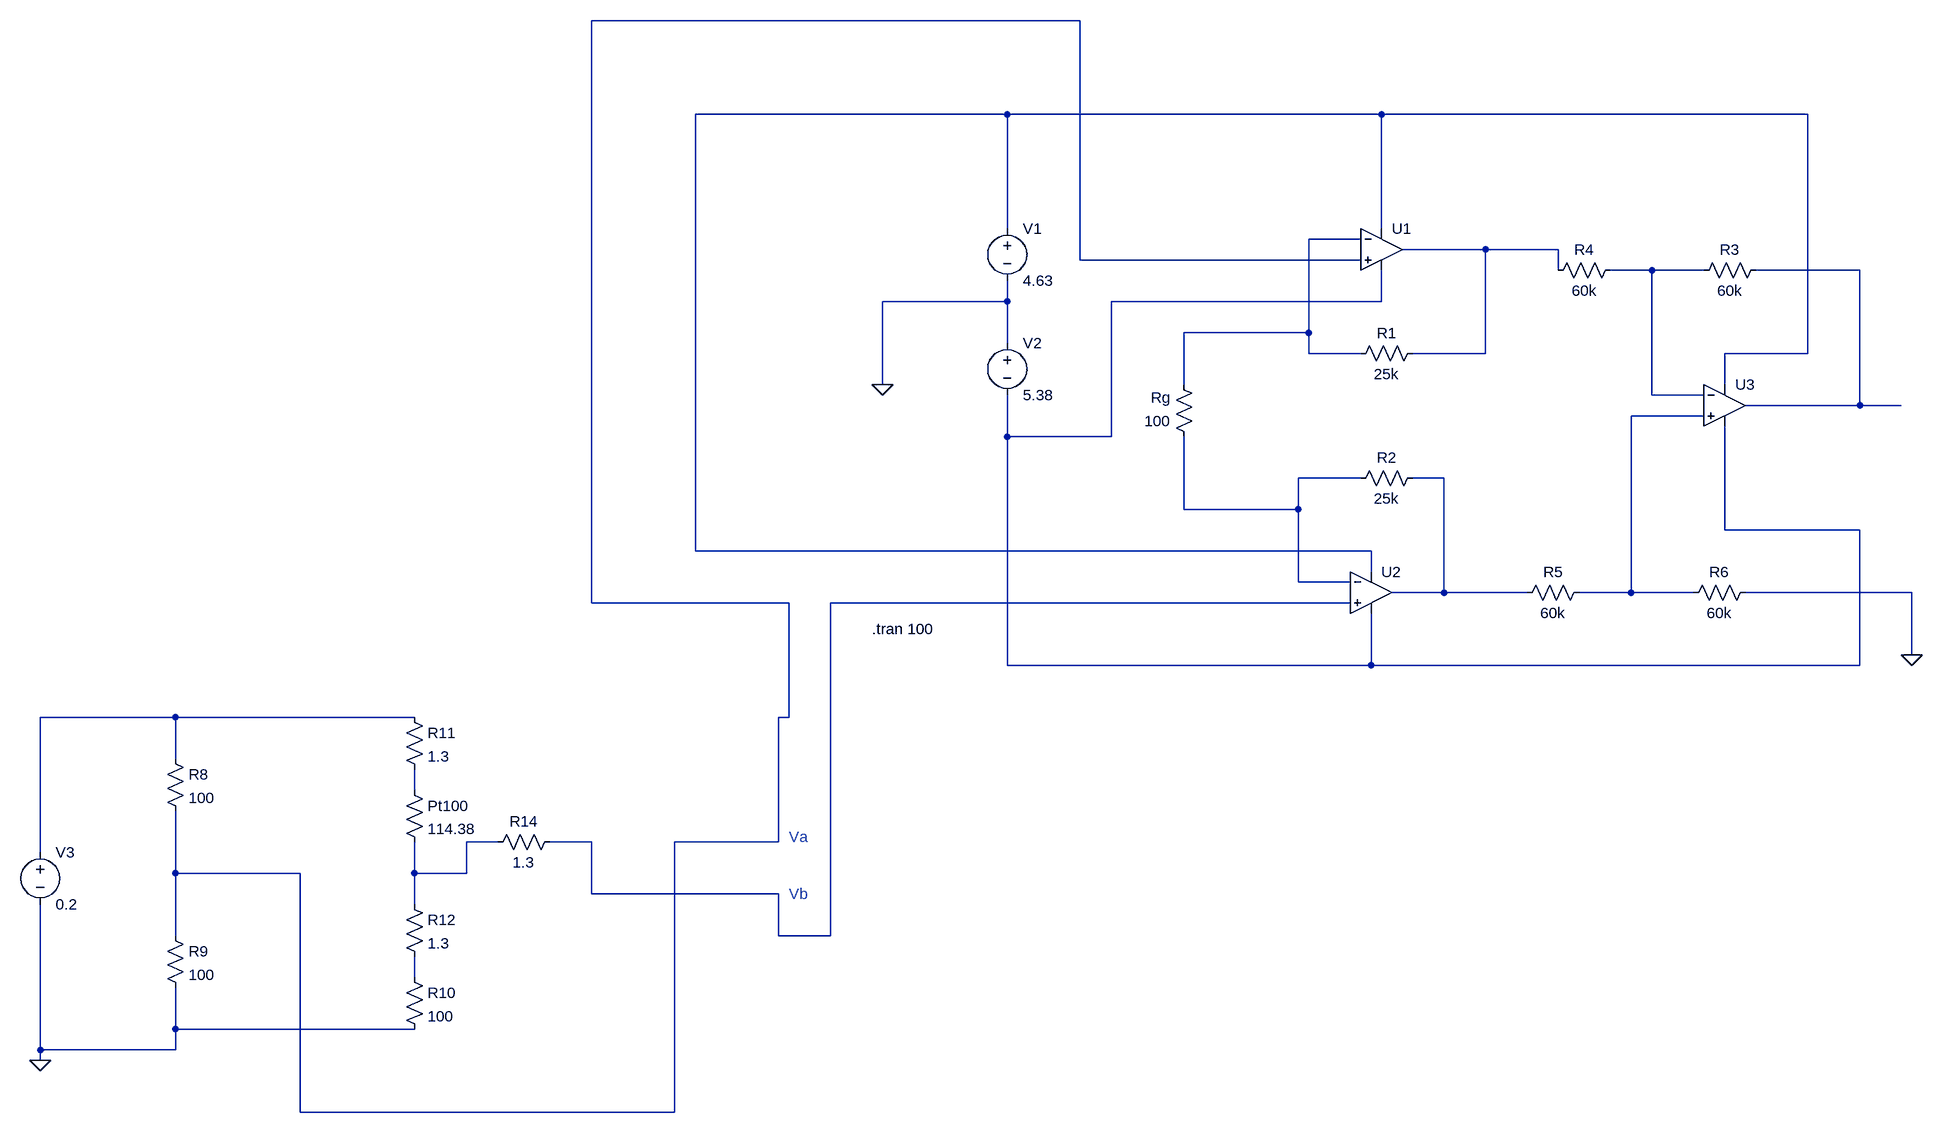
[diagram p0: schematic simulacaoINA118_com_ponte.asc]
simulacaoINA118_com_ponte.asc, the LTspice schematic file:
Version 4.1
SHEET 1 1108 1412
WIRE -544 -272 -1296 -272
WIRE -656 -128 -1136 -128
WIRE -80 -128 -656 -128
WIRE 576 -128 -80 -128
WIRE -656 48 -656 -128
WIRE -80 48 -80 -128
WIRE -112 64 -192 64
WIRE 80 80 -48 80
WIRE 192 80 80 80
WIRE -544 96 -544 -272
WIRE -112 96 -544 96
WIRE 192 112 192 80
WIRE 336 112 272 112
WIRE 416 112 336 112
WIRE 656 112 496 112
WIRE -656 160 -656 128
WIRE -656 160 -848 160
WIRE -80 160 -80 112
WIRE -80 160 -496 160
WIRE -192 208 -192 64
WIRE -192 208 -384 208
WIRE -656 224 -656 160
WIRE -192 240 -192 208
WIRE -112 240 -192 240
WIRE 80 240 80 80
WIRE 80 240 -32 240
WIRE 576 240 576 -128
WIRE 576 240 448 240
WIRE -848 288 -848 160
WIRE -384 288 -384 208
WIRE 448 288 448 240
WIRE 336 304 336 112
WIRE 416 304 336 304
WIRE 656 320 656 112
WIRE 656 320 480 320
WIRE 720 320 656 320
WIRE 416 336 304 336
WIRE -656 368 -656 304
WIRE -496 368 -496 160
WIRE -496 368 -656 368
WIRE -112 432 -208 432
WIRE 16 432 -32 432
WIRE -384 480 -384 368
WIRE -208 480 -208 432
WIRE -208 480 -384 480
WIRE 448 512 448 352
WIRE 656 512 448 512
WIRE -1136 544 -1136 -128
WIRE -96 544 -1136 544
WIRE -96 576 -96 544
WIRE -208 592 -208 480
WIRE -128 592 -208 592
WIRE 16 608 16 432
WIRE 16 608 -64 608
WIRE 144 608 16 608
WIRE 304 608 304 336
WIRE 304 608 224 608
WIRE 400 608 304 608
WIRE 736 608 480 608
WIRE -1296 624 -1296 -272
WIRE -992 624 -1296 624
WIRE -128 624 -928 624
WIRE 736 704 736 608
WIRE -656 720 -656 368
WIRE -96 720 -96 640
WIRE -96 720 -656 720
WIRE 656 720 656 512
WIRE 656 720 -96 720
WIRE -1936 800 -2144 800
WIRE -1568 800 -1936 800
WIRE -992 800 -992 624
WIRE -992 800 -1008 800
WIRE -1936 864 -1936 800
WIRE -1568 912 -1568 880
WIRE -1440 992 -1488 992
WIRE -1296 992 -1360 992
WIRE -1008 992 -1008 800
WIRE -1008 992 -1168 992
WIRE -2144 1008 -2144 800
WIRE -1936 1040 -1936 944
WIRE -1744 1040 -1936 1040
WIRE -1568 1040 -1568 992
WIRE -1488 1040 -1488 992
WIRE -1488 1040 -1568 1040
WIRE -1296 1072 -1296 992
WIRE -1008 1072 -1296 1072
WIRE -1568 1088 -1568 1040
WIRE -1936 1136 -1936 1040
WIRE -1008 1136 -1008 1072
WIRE -928 1136 -928 624
WIRE -928 1136 -1008 1136
WIRE -1568 1200 -1568 1168
WIRE -1936 1280 -1936 1216
WIRE -1568 1280 -1936 1280
WIRE -2144 1312 -2144 1088
WIRE -1936 1312 -1936 1280
WIRE -1936 1312 -2144 1312
WIRE -2144 1328 -2144 1312
WIRE -1744 1408 -1744 1040
WIRE -1168 1408 -1168 992
WIRE -1168 1408 -1744 1408
FLAG -848 288 0
FLAG 736 704 0
FLAG -2144 1328 0
SYMBOL res -16 224 R90
WINDOW 0 0 56 VBottom 2
WINDOW 3 32 56 VTop 2
SYMATTR InstName R1
SYMATTR Value 25k
SYMBOL res -16 416 R90
WINDOW 0 0 56 VBottom 2
WINDOW 3 32 56 VTop 2
SYMATTR InstName R2
SYMATTR Value 25k
SYMBOL res 512 96 R90
WINDOW 0 0 56 VBottom 2
WINDOW 3 32 56 VTop 2
SYMATTR InstName R3
SYMATTR Value 60k
SYMBOL res 288 96 R90
WINDOW 0 0 56 VBottom 2
WINDOW 3 32 56 VTop 2
SYMATTR InstName R4
SYMATTR Value 60k
SYMBOL res 240 592 R90
WINDOW 0 0 56 VBottom 2
WINDOW 3 32 56 VTop 2
SYMATTR InstName R5
SYMATTR Value 60k
SYMBOL res 496 592 R90
WINDOW 0 0 56 VBottom 2
WINDOW 3 32 56 VTop 2
SYMATTR InstName R6
SYMATTR Value 60k
SYMBOL res -368 384 R180
WINDOW 0 36 76 Left 2
WINDOW 3 36 40 Left 2
SYMATTR InstName Rg
SYMATTR Value 100
SYMBOL voltage -656 32 R0
WINDOW 123 0 0 Left 0
WINDOW 39 0 0 Left 0
SYMATTR InstName V1
SYMATTR Value 4.63
SYMBOL voltage -656 208 R0
WINDOW 123 0 0 Left 0
WINDOW 39 0 0 Left 0
SYMATTR InstName V2
SYMATTR Value 5.38
SYMBOL OpAmps\\UniversalOpAmp -80 80 R0
SYMATTR InstName U1
SYMBOL OpAmps\\UniversalOpAmp -96 608 R0
SYMATTR InstName U2
SYMBOL OpAmps\\UniversalOpAmp 448 320 R0
SYMATTR InstName U3
SYMBOL voltage -2144 992 R0
WINDOW 123 0 0 Left 0
WINDOW 39 0 0 Left 0
SYMATTR InstName V3
SYMATTR Value 0.2
SYMBOL res -1952 848 R0
SYMATTR InstName R8
SYMATTR Value 100
SYMBOL res -1952 1120 R0
SYMATTR InstName R9
SYMATTR Value 100
SYMBOL res -1584 1184 R0
SYMATTR InstName R10
SYMATTR Value 100
SYMBOL res -1584 896 R0
SYMATTR InstName Pt100
SYMATTR Value 114.38
SYMBOL res -1584 784 R0
SYMATTR InstName R11
SYMATTR Value 1.3
SYMBOL res -1584 1072 R0
SYMATTR InstName R12
SYMATTR Value 1.3
SYMBOL res -1344 976 R90
WINDOW 0 0 56 VBottom 2
WINDOW 3 32 56 VTop 2
SYMATTR InstName R14
SYMATTR Value 1.3
TEXT -864 664 Left 2 !.tran 100
TEXT -992 984 Left 2 ;Va
TEXT -992 1072 Left 2 ;Vb

The netlist it stands for:
* simulacaoINA118_com_ponte.asc
R1 N004 N003 25k
R2 N010 N009 25k
R3 N006 N005 60k
R4 N005 N004 60k
R5 N008 N010 60k
R6 0 N008 60k
Rg N009 N003 100
V1 N002 0 4.63
V2 0 N007 5.38
X§U1 N001 N003 N002 N007 N004 level1 Avol=1Meg GBW=10Meg Vos=0 En=0 Enk=0 In=0 Ink=0 Rin=500Meg  ; pins In+ In- V+ V- OUT
X§U2 N011 N009 N002 N007 N010 level1 Avol=1Meg GBW=10Meg Vos=0 En=0 Enk=0 In=0 Ink=0 Rin=500Meg  ; pins In+ In- V+ V- OUT
X§U3 N008 N005 N002 N007 N006 level1 Avol=1Meg GBW=10Meg Vos=0 En=0 Enk=0 In=0 Ink=0 Rin=500Meg  ; pins In+ In- V+ V- OUT
V3 N012 0 0.2
R8 N012 N001 100
R9 N001 0 100
R10 N015 0 100
R§Pt100 N013 N014 114.38
R11 N012 N013 1.3
R12 N014 N015 1.3
R14 N011 N014 1.3
.tran 100
* Va
* Vb
.lib UniversalOpAmp1.lib
.backanno
.end